# EAGLE design CoprocessorBoard3.0 (EAGLE 8.4.0)
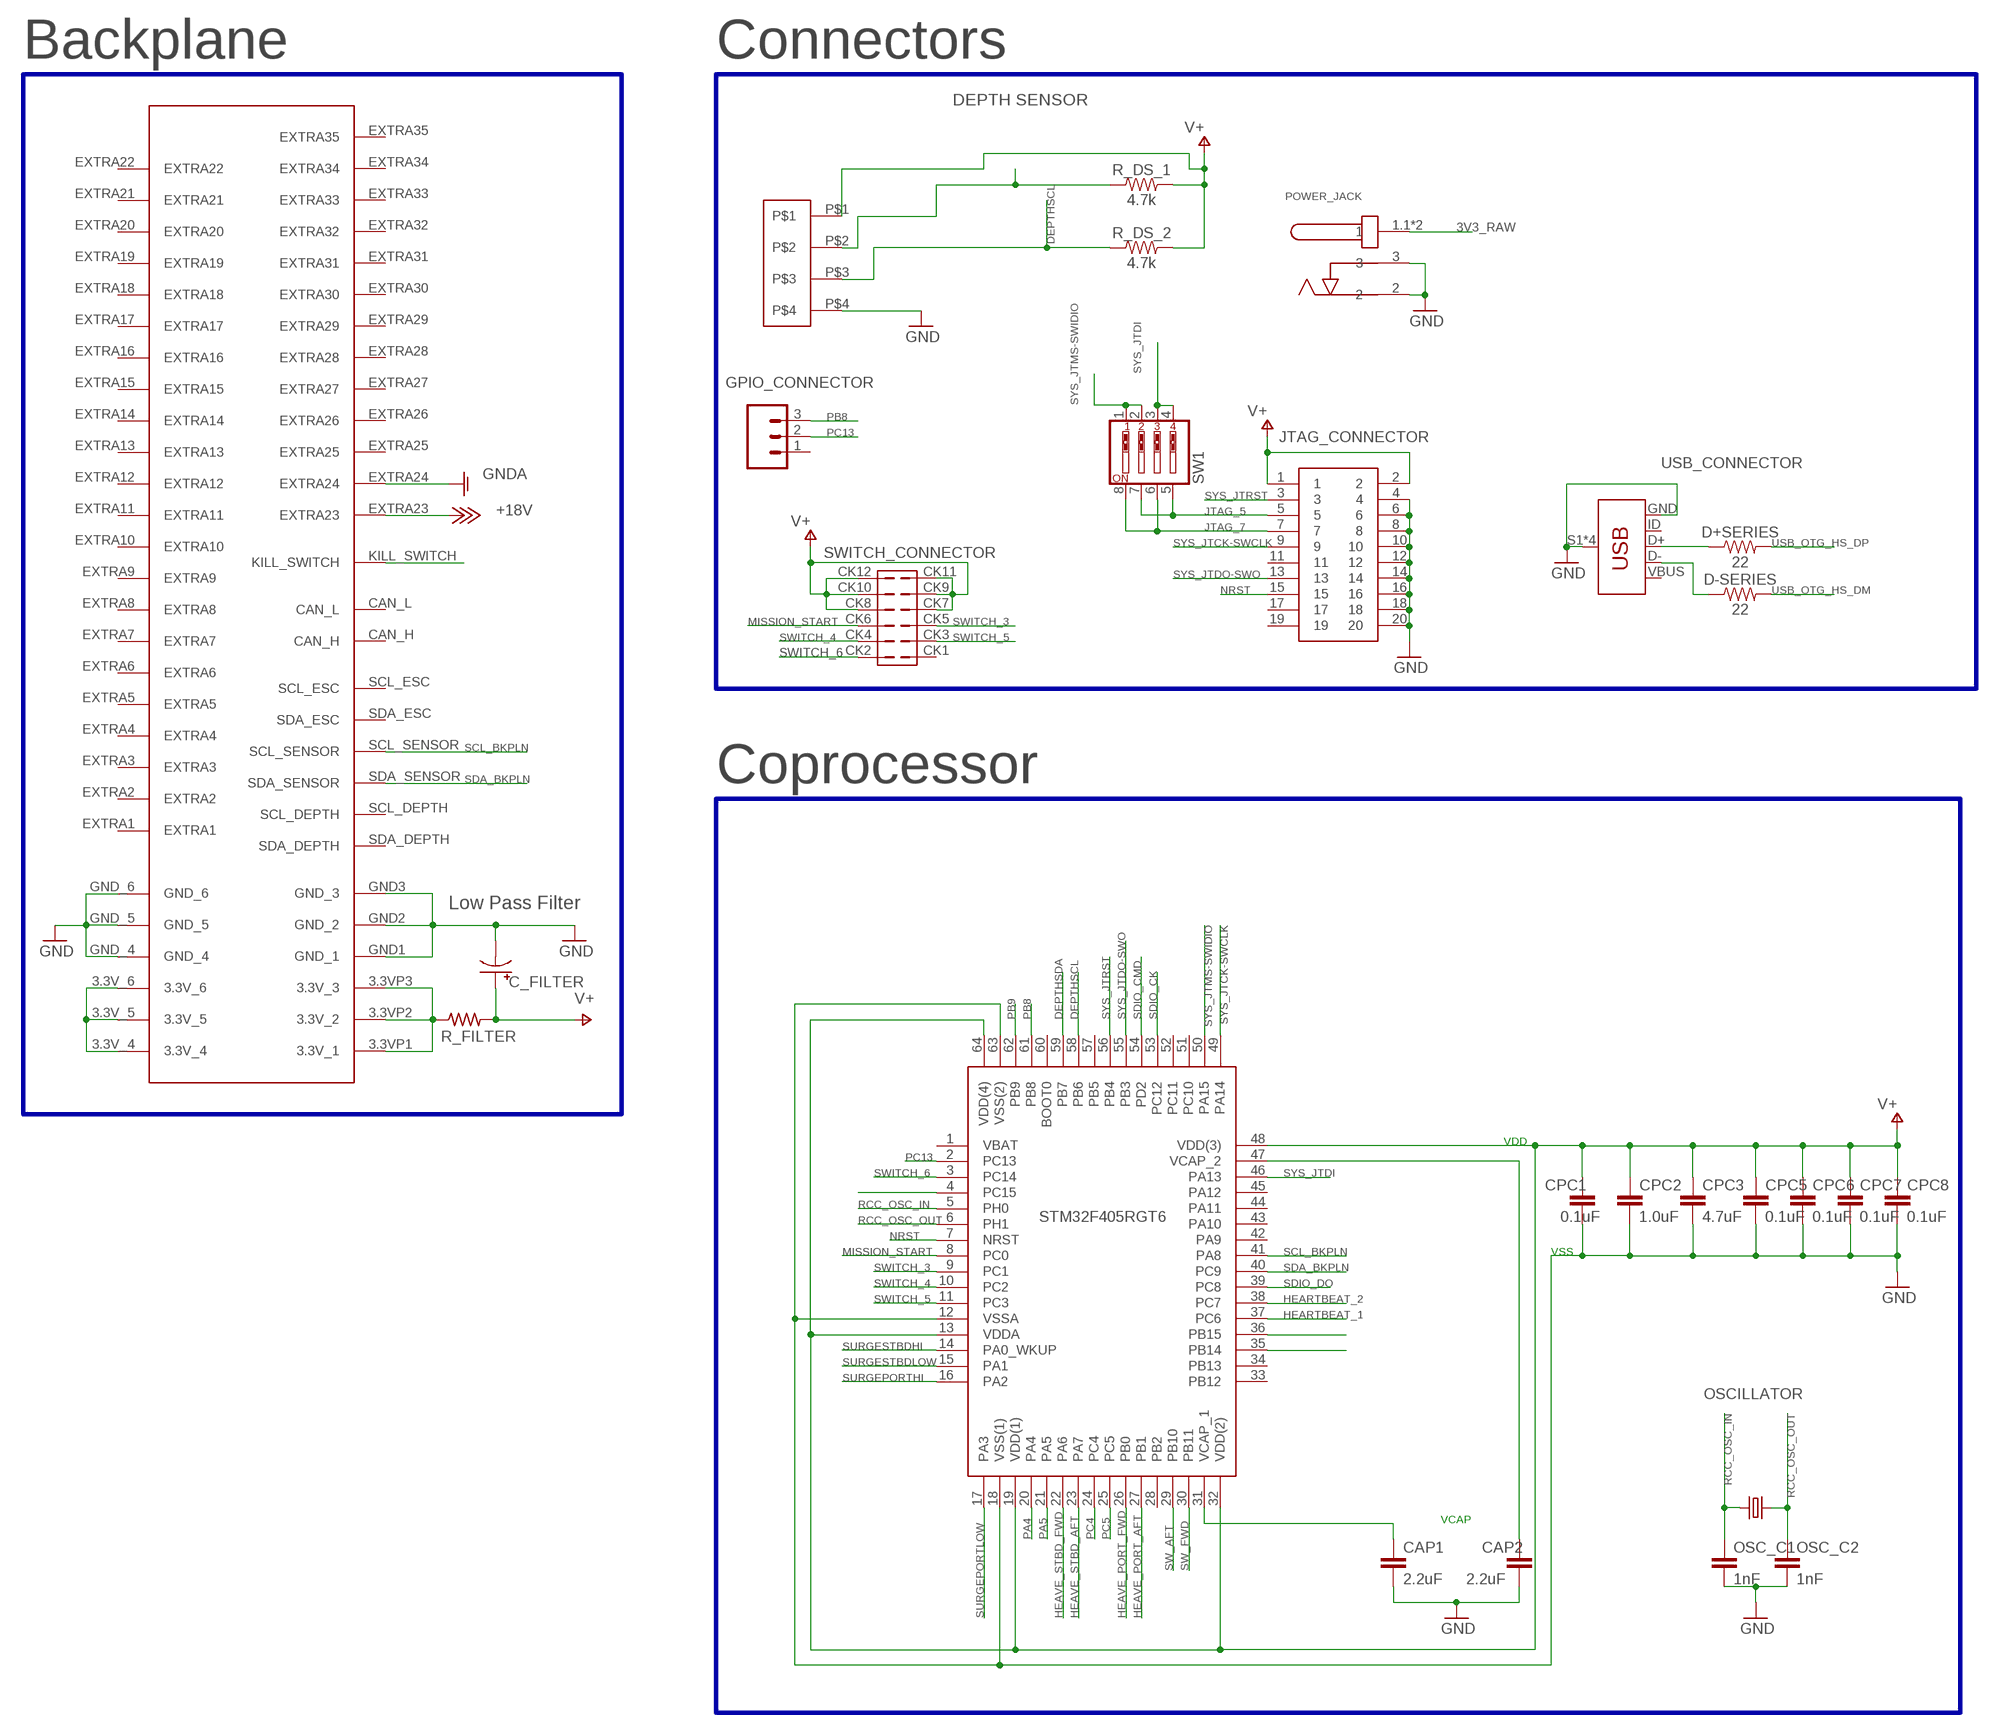
[diagram p0: schematic, sheet 1, part 1 of 2]
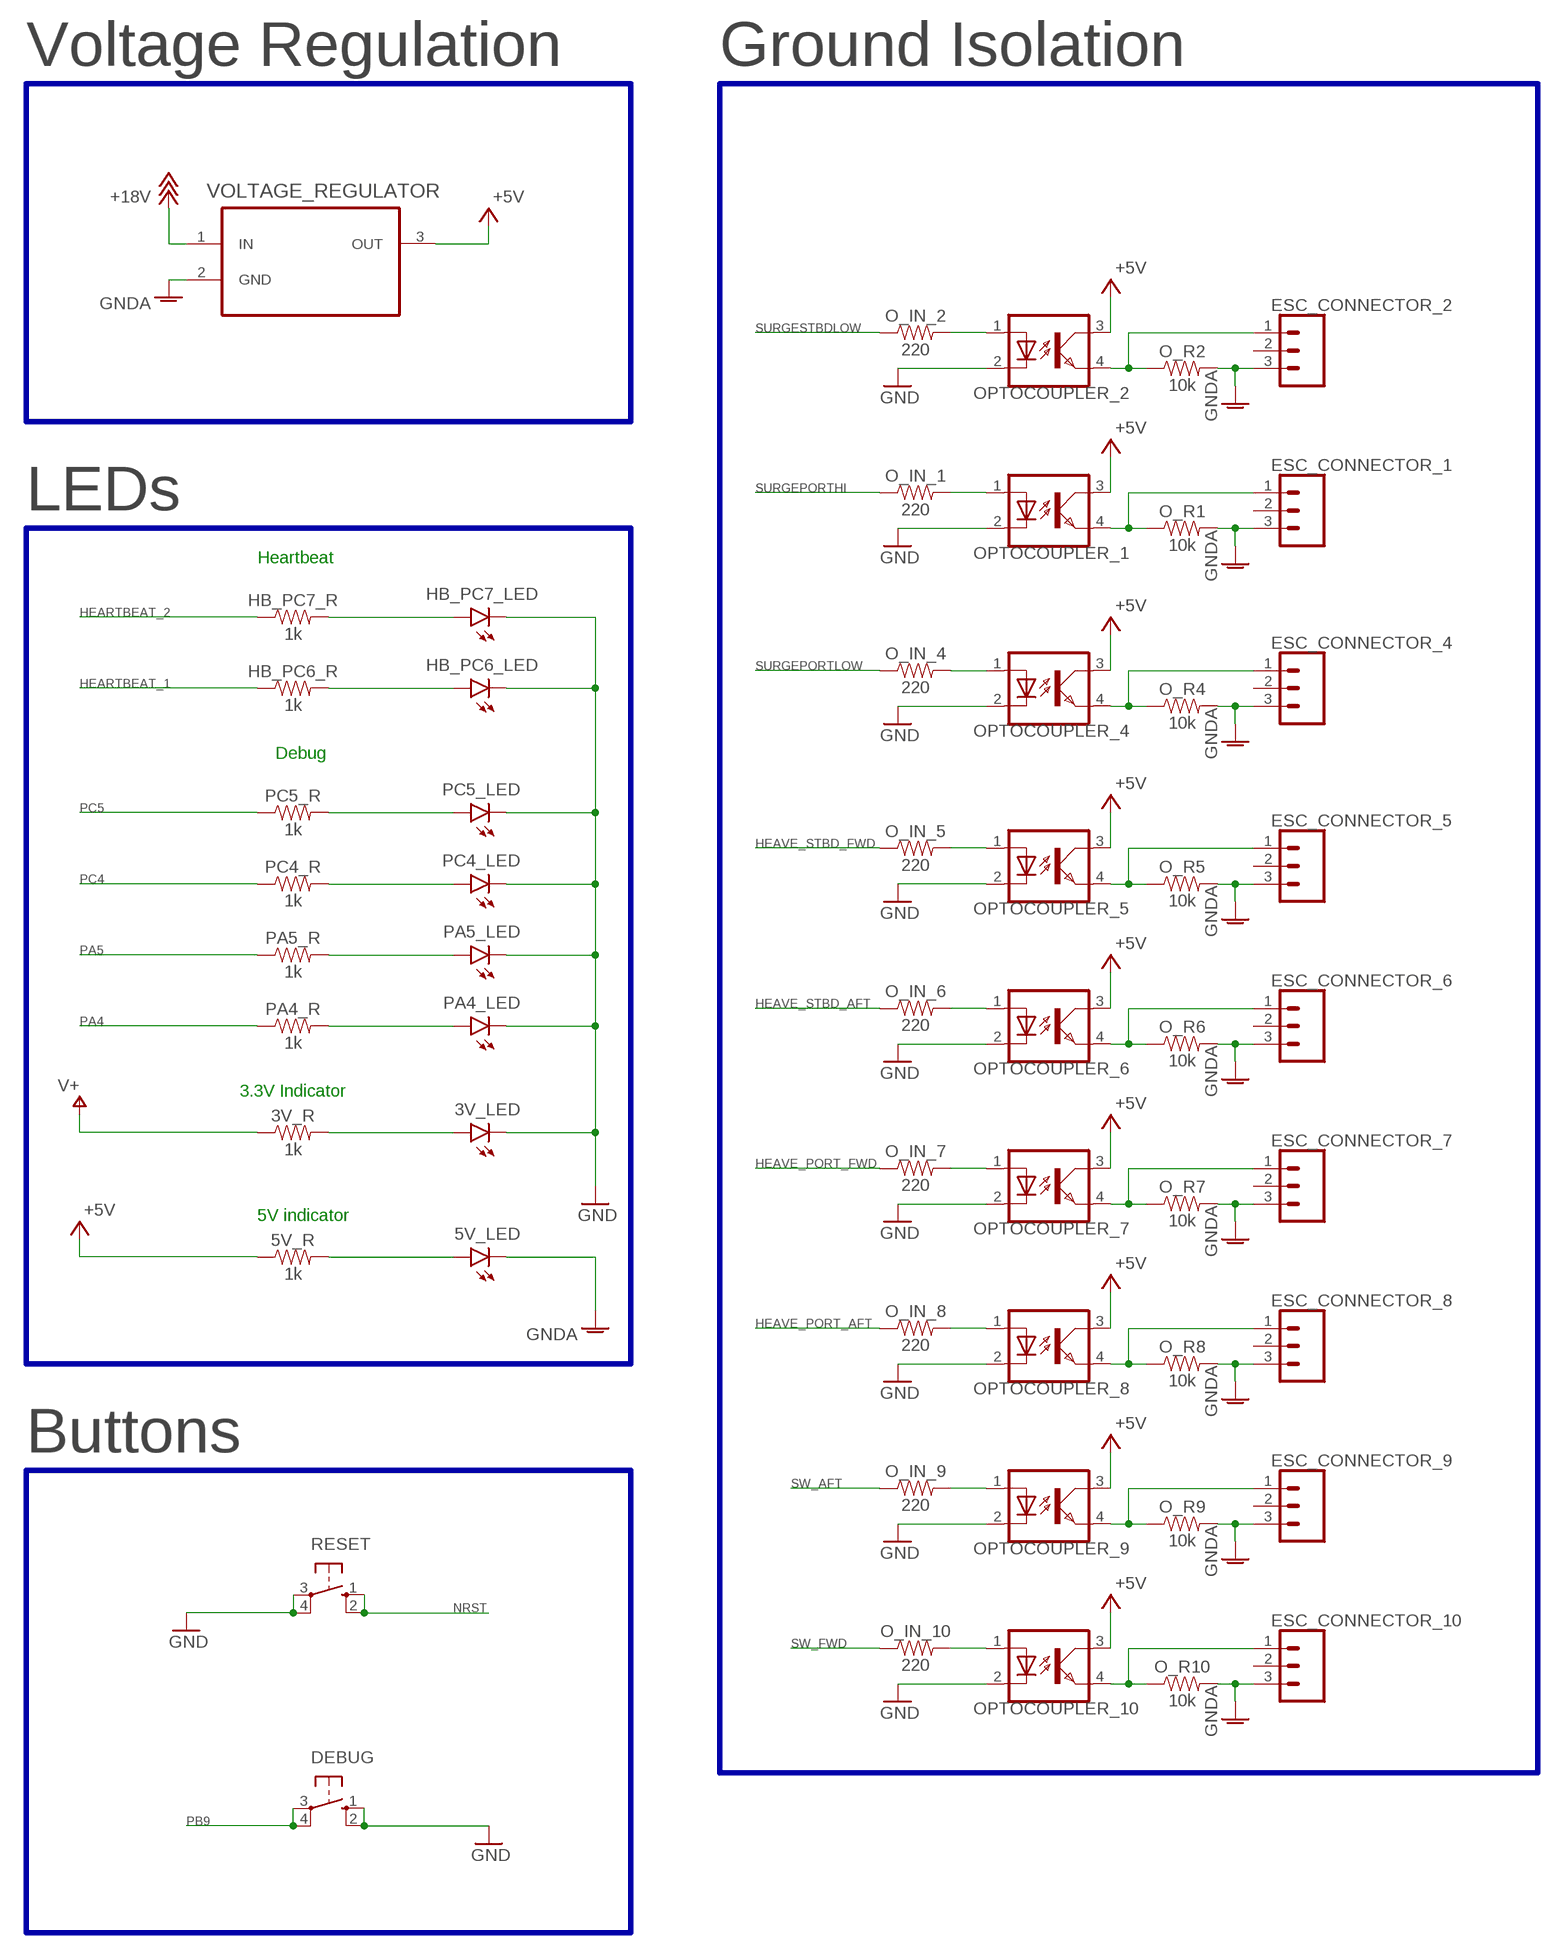
[diagram p1: schematic, sheet 1, part 2 of 2]

## Parts
3V_LED  WHITE  LED-WHITE0603  [LED-0603]
3V_R  1k  1KOHM-HORIZ-1/4W-1%  [AXIAL-0.3]
5V_LED  WHITE  LED-WHITE0603  [LED-0603]
5V_R  1k  1KOHM-HORIZ-1/4W-1%  [AXIAL-0.3]
C_FILTER  CPOL-USE2-5  [E2-5]
CAP1  2.2uF  2.2UF-0603-10V-20%  [0603]
CAP2  2.2uF  2.2UF-0603-10V-20%  [0603]
CPC1  0.1uF  1.0NF/1000PF-0603-50V-10%  [0603]
CPC2  1.0uF  1.0UF-0603-16V-10%  [0603]
CPC3  4.7uF  4.7UF0603  [0603]
CPC5  0.1uF  1.0NF/1000PF-0603-50V-10%  [0603]
CPC6  0.1uF  1.0NF/1000PF-0603-50V-10%  [0603]
CPC7  0.1uF  1.0NF/1000PF-0603-50V-10%  [0603]
CPC8  0.1uF  1.0NF/1000PF-0603-50V-10%  [0603]
D+SERIES  22  1KOHM-HORIZ-1/4W-1%  [AXIAL-0.3]
D-SERIES  22  1KOHM-HORIZ-1/4W-1%  [AXIAL-0.3]
DEBUG  10-XX  [B3F-10XX]
ESC_CONNECTOR_1  455-1750-1-ND  CONN_03  [1X03]
ESC_CONNECTOR_2  455-1750-1-ND  CONN_03  [1X03]
ESC_CONNECTOR_4  455-1750-1-ND  CONN_03  [1X03]
ESC_CONNECTOR_5  455-1750-1-ND  CONN_03  [1X03]
ESC_CONNECTOR_6  455-1750-1-ND  CONN_03  [1X03]
ESC_CONNECTOR_7  455-1750-1-ND  CONN_03  [1X03]
ESC_CONNECTOR_8  455-1750-1-ND  CONN_03  [1X03]
ESC_CONNECTOR_9  455-1750-1-ND  CONN_03  [1X03]
ESC_CONNECTOR_10  455-1750-1-ND  CONN_03  [1X03]
GPIO_CONNECTOR  455-1750-1-ND  CONN_03  [1X03]
HB_PC6_LED  WHITE  LED-WHITE0603  [LED-0603]
HB_PC6_R  1k  1KOHM-HORIZ-1/4W-1%  [AXIAL-0.3]
HB_PC7_LED  WHITE  LED-WHITE0603  [LED-0603]
HB_PC7_R  1k  1KOHM-HORIZ-1/4W-1%  [AXIAL-0.3]
IC1  STM32F405RGT6  [QFP50P1200X1200X160-64N]
JTAG_CONNECTOR  30320-6002HB  [SHDR20W81P254_2X10_3300X840X93]
O_IN_1  220  1KOHM-HORIZ-1/4W-1%  [AXIAL-0.3]
O_IN_2  220  1KOHM-HORIZ-1/4W-1%  [AXIAL-0.3]
O_IN_4  220  1KOHM-HORIZ-1/4W-1%  [AXIAL-0.3]
O_IN_5  220  1KOHM-HORIZ-1/4W-1%  [AXIAL-0.3]
O_IN_6  220  1KOHM-HORIZ-1/4W-1%  [AXIAL-0.3]
O_IN_7  220  1KOHM-HORIZ-1/4W-1%  [AXIAL-0.3]
O_IN_8  220  1KOHM-HORIZ-1/4W-1%  [AXIAL-0.3]
O_IN_9  220  1KOHM-HORIZ-1/4W-1%  [AXIAL-0.3]
O_IN_10  220  1KOHM-HORIZ-1/4W-1%  [AXIAL-0.3]
O_R1  10k  1KOHM-HORIZ-1/4W-1%  [AXIAL-0.3]
O_R2  10k  1KOHM-HORIZ-1/4W-1%  [AXIAL-0.3]
O_R4  10k  1KOHM-HORIZ-1/4W-1%  [AXIAL-0.3]
O_R5  10k  1KOHM-HORIZ-1/4W-1%  [AXIAL-0.3]
O_R6  10k  1KOHM-HORIZ-1/4W-1%  [AXIAL-0.3]
O_R7  10k  1KOHM-HORIZ-1/4W-1%  [AXIAL-0.3]
O_R8  10k  1KOHM-HORIZ-1/4W-1%  [AXIAL-0.3]
O_R9  10k  1KOHM-HORIZ-1/4W-1%  [AXIAL-0.3]
O_R10  10k  1KOHM-HORIZ-1/4W-1%  [AXIAL-0.3]
OPTOCOUPLER_1  SFH610  [DIL04]
OPTOCOUPLER_2  SFH610  [DIL04]
OPTOCOUPLER_4  SFH610  [DIL04]
OPTOCOUPLER_5  SFH610  [DIL04]
OPTOCOUPLER_6  SFH610  [DIL04]
OPTOCOUPLER_7  SFH610  [DIL04]
OPTOCOUPLER_8  SFH610  [DIL04]
OPTOCOUPLER_9  SFH610  [DIL04]
OPTOCOUPLER_10  SFH610  [DIL04]
OSC_C1  1nF  22PF-PTH-2.54MM-200V-5%  [CAP-PTH-2.54]
OSC_C2  1nF  22PF-PTH-2.54MM-200V-5%  [CAP-PTH-2.54]
OSCILLATOR  CRYSTALHC49S  [HC49/S]
PA4_LED  WHITE  LED-WHITE0603  [LED-0603]
PA4_R  1k  1KOHM-HORIZ-1/4W-1%  [AXIAL-0.3]
PA5_LED  WHITE  LED-WHITE0603  [LED-0603]
PA5_R  1k  1KOHM-HORIZ-1/4W-1%  [AXIAL-0.3]
PC4_LED  WHITE  LED-WHITE0603  [LED-0603]
PC4_R  1k  1KOHM-HORIZ-1/4W-1%  [AXIAL-0.3]
PC5_LED  WHITE  LED-WHITE0603  [LED-0603]
PC5_R  1k  1KOHM-HORIZ-1/4W-1%  [AXIAL-0.3]
POWER_JACK  PJ-002AH-SMT-TR  [CUI_PJ-002AH-SMT-TR]
R_DS_1  4.7k  1KOHM-HORIZ-1/4W-1%  [AXIAL-0.3]
R_DS_2  4.7k  1KOHM-HORIZ-1/4W-1%  [AXIAL-0.3]
R_FILTER  R-US_0204/7  [0204/7]
RESET  10-XX  [B3F-10XX]
SW1  SW_DIP-4  [EDG-04]
SWITCH_CONNECTOR  105314-2112  [105314-2112]
U$1  5530843  [5530843-6-BOARDFINGERS]
U$2  NANOFIT_4PIN_STR  [NANOFIT_4PIN_STR]
USB_CONNECTOR  USB_MINI-B_SMT  [USB-MINIB]
VOLTAGE_REGULATOR  L78M05CV  [TO254P450X1020X1935-3P]

## Nets
3V3: 3V_R.P$1 C_FILTER.+ CPC1.1 CPC2.1 CPC3.1 CPC5.1 CPC6.1 CPC7.1 CPC8.1 IC1.13(VDDA) IC1.19(VDD(1)) IC1.32(VDD(2)) IC1.48(VDD(3)) IC1.64(VDD(4)) JTAG_CONNECTOR.1 JTAG_CONNECTOR.2 R_DS_1.P$2 R_DS_2.P$2 R_FILTER.2 SWITCH_CONNECTOR.CK7 SWITCH_CONNECTOR.CK8 SWITCH_CONNECTOR.CK9 SWITCH_CONNECTOR.CK10 SWITCH_CONNECTOR.CK11 SWITCH_CONNECTOR.CK12 U$2.P$1 ; supply symbol labelled V+
3V3_RAW: POWER_JACK.1.1 POWER_JACK.1.2 R_FILTER.1 U$1.3.3V_4 U$1.3.3V_5 U$1.3.3V_6 U$1.3.3VP1(3.3V_1) U$1.3.3VP2(3.3V_2) U$1.3.3VP3(3.3V_3)
+5V: 5V_R.P$1 OPTOCOUPLER_1.3(COL) OPTOCOUPLER_2.3(COL) OPTOCOUPLER_4.3(COL) OPTOCOUPLER_5.3(COL) OPTOCOUPLER_6.3(COL) OPTOCOUPLER_7.3(COL) OPTOCOUPLER_8.3(COL) OPTOCOUPLER_9.3(COL) OPTOCOUPLER_10.3(COL) VOLTAGE_REGULATOR.3(OUT)
+18V: U$1.EXTRA23 VOLTAGE_REGULATOR.1(IN)
D+CON: D+SERIES.P$1 USB_CONNECTOR.D+
D-CON: D-SERIES.P$1 USB_CONNECTOR.D-
DEPTHSCL: IC1.58(PB6) R_DS_2.P$1 U$2.P$3
DEPTHSDA: IC1.59(PB7) R_DS_1.P$1 U$2.P$2
GND: 3V_LED.C C_FILTER.- CAP1.2 CAP2.2 CPC1.2 CPC2.2 CPC3.2 CPC5.2 CPC6.2 CPC7.2 CPC8.2 DEBUG.1(S) DEBUG.2(S1) HB_PC6_LED.C HB_PC7_LED.C IC1.12(VSSA) IC1.18(VSS(1)) IC1.63(VSS(2)) JTAG_CONNECTOR.4 JTAG_CONNECTOR.6 JTAG_CONNECTOR.8 JTAG_CONNECTOR.10 JTAG_CONNECTOR.12 JTAG_CONNECTOR.14 JTAG_CONNECTOR.16 JTAG_CONNECTOR.18 JTAG_CONNECTOR.20 OPTOCOUPLER_1.2(C) OPTOCOUPLER_2.2(C) OPTOCOUPLER_4.2(C) OPTOCOUPLER_5.2(C) OPTOCOUPLER_6.2(C) OPTOCOUPLER_7.2(C) OPTOCOUPLER_8.2(C) OPTOCOUPLER_9.2(C) OPTOCOUPLER_10.2(C) OSC_C1.2 OSC_C2.2 PA4_LED.C PA5_LED.C PC4_LED.C PC5_LED.C POWER_JACK.2 POWER_JACK.3 RESET.3(P) RESET.4(P1) U$1.GND1(GND_1) U$1.GND2(GND_2) U$1.GND3(GND_3) U$1.GND_4 U$1.GND_5 U$1.GND_6 U$2.P$4 USB_CONNECTOR.GND USB_CONNECTOR.S1(SHIELD) USB_CONNECTOR.S2(SHIELD) USB_CONNECTOR.S3(SHIELD) USB_CONNECTOR.S4(SHIELD)
GNDBAT: 5V_LED.C ESC_CONNECTOR_1.3 ESC_CONNECTOR_2.3 ESC_CONNECTOR_4.3 ESC_CONNECTOR_5.3 ESC_CONNECTOR_6.3 ESC_CONNECTOR_7.3 ESC_CONNECTOR_8.3 ESC_CONNECTOR_9.3 ESC_CONNECTOR_10.3 O_R1.P$2 O_R2.P$2 O_R4.P$2 O_R5.P$2 O_R6.P$2 O_R7.P$2 O_R8.P$2 O_R9.P$2 O_R10.P$2 U$1.EXTRA24 VOLTAGE_REGULATOR.2(GND) ; supply symbol labelled GNDA
HEARTBEAT_1: HB_PC6_R.P$1 IC1.37(PC6)
HEARTBEAT_2: HB_PC7_R.P$1 IC1.38(PC7)
HEAVE_PORT_AFT: IC1.27(PB1) O_IN_8.P$1
HEAVE_PORT_FWD: IC1.26(PB0) O_IN_7.P$1
HEAVE_STBD_AFT: IC1.23(PA7) O_IN_6.P$1
HEAVE_STBD_FWD: IC1.22(PA6) O_IN_5.P$1
JTAG_5: JTAG_CONNECTOR.5 SW1.5 SW1.7
JTAG_7: JTAG_CONNECTOR.7 SW1.6 SW1.8
KILL_SWITCH: IC1.4(PC15) U$1.KILL_SWITCH
MISSION_START: IC1.8(PC0) SWITCH_CONNECTOR.CK6
N$1: ESC_CONNECTOR_1.1 O_R1.P$1 OPTOCOUPLER_1.4(EMIT)
N$2: ESC_CONNECTOR_2.1 O_R2.P$1 OPTOCOUPLER_2.4(EMIT)
N$3: O_IN_1.P$2 OPTOCOUPLER_1.1(A)
N$6: ESC_CONNECTOR_4.1 O_R4.P$1 OPTOCOUPLER_4.4(EMIT)
N$7: ESC_CONNECTOR_5.1 O_R5.P$1 OPTOCOUPLER_5.4(EMIT)
N$8: ESC_CONNECTOR_6.1 O_R6.P$1 OPTOCOUPLER_6.4(EMIT)
N$9: ESC_CONNECTOR_7.1 O_R7.P$1 OPTOCOUPLER_7.4(EMIT)
N$10: ESC_CONNECTOR_8.1 O_R8.P$1 OPTOCOUPLER_8.4(EMIT)
N$11: ESC_CONNECTOR_9.1 O_R9.P$1 OPTOCOUPLER_9.4(EMIT)
N$12: ESC_CONNECTOR_10.1 O_R10.P$1 OPTOCOUPLER_10.4(EMIT)
N$13: O_IN_10.P$2 OPTOCOUPLER_10.1(A)
N$14: O_IN_9.P$2 OPTOCOUPLER_9.1(A)
N$15: O_IN_8.P$2 OPTOCOUPLER_8.1(A)
N$16: O_IN_7.P$2 OPTOCOUPLER_7.1(A)
N$17: O_IN_6.P$2 OPTOCOUPLER_6.1(A)
N$18: O_IN_5.P$2 OPTOCOUPLER_5.1(A)
N$19: O_IN_4.P$2 OPTOCOUPLER_4.1(A)
N$21: O_IN_2.P$2 OPTOCOUPLER_2.1(A)
N$36: HB_PC6_LED.A HB_PC6_R.P$2
N$37: HB_PC7_LED.A HB_PC7_R.P$2
N$38: PC5_LED.A PC5_R.P$2
N$39: PC4_LED.A PC4_R.P$2
N$40: PA5_LED.A PA5_R.P$2
N$41: PA4_LED.A PA4_R.P$2
N$42: 5V_LED.A 5V_R.P$2
N$43: 3V_LED.A 3V_R.P$2
NRST: IC1.7(NRST) JTAG_CONNECTOR.15 RESET.1(S) RESET.2(S1)
PA4: IC1.20(PA4) PA4_R.P$1
PA5: IC1.21(PA5) PA5_R.P$1
PB8: GPIO_CONNECTOR.3 IC1.61(PB8)
PB9: DEBUG.3(P) DEBUG.4(P1) IC1.62(PB9)
PC4: IC1.24(PC4) PC4_R.P$1
PC5: IC1.25(PC5) PC5_R.P$1
PC13: GPIO_CONNECTOR.2 IC1.2(PC13)
RCC_OSC_IN: IC1.5(PH0) OSC_C1.1 OSCILLATOR.1
RCC_OSC_OUT: IC1.6(PH1) OSC_C2.1 OSCILLATOR.2
SCL_BKPLN: IC1.41(PA8) U$1.SCL_SENSOR
SDA_BKPLN: IC1.40(PC9) U$1.SDA_SENSOR
SDIO_CK: IC1.53(PC12)
SDIO_CMD: IC1.54(PD2)
SDIO_DO: IC1.39(PC8)
SURGEPORTHI: IC1.16(PA2) O_IN_1.P$1
SURGEPORTLOW: IC1.17(PA3) O_IN_4.P$1
SURGESTBDHI: IC1.14(PA0_WKUP)
SURGESTBDLOW: IC1.15(PA1) O_IN_2.P$1
SW_AFT: IC1.29(PB10) O_IN_9.P$1
SW_FWD: IC1.30(PB11) O_IN_10.P$1
SWITCH_3: IC1.9(PC1) SWITCH_CONNECTOR.CK5
SWITCH_4: IC1.10(PC2) SWITCH_CONNECTOR.CK4
SWITCH_5: IC1.11(PC3) SWITCH_CONNECTOR.CK3
SWITCH_6: IC1.3(PC14) SWITCH_CONNECTOR.CK2
SYS_JTCK-SWCLK: IC1.49(PA14) JTAG_CONNECTOR.9
SYS_JTDI: IC1.46(PA13) SW1.3 SW1.4
SYS_JTDO-SWO: IC1.55(PB3) JTAG_CONNECTOR.13
SYS_JTMS-SWIDIO: IC1.50(PA15) SW1.1 SW1.2
SYS_JTRST: IC1.56(PB4) JTAG_CONNECTOR.3
USB_OTG_HS_DM: D-SERIES.P$2 IC1.35(PB14)
USB_OTG_HS_DP: D+SERIES.P$2 IC1.36(PB15)
VCAP1: CAP1.1 IC1.31(VCAP_1)
VCAP2: CAP2.1 IC1.47(VCAP_2)
Unconnected: ESC_CONNECTOR_1.2 ESC_CONNECTOR_2.2 ESC_CONNECTOR_4.2 ESC_CONNECTOR_5.2 ESC_CONNECTOR_6.2 ESC_CONNECTOR_7.2 ESC_CONNECTOR_8.2 ESC_CONNECTOR_9.2 ESC_CONNECTOR_10.2 GPIO_CONNECTOR.1 IC1.1(VBAT) IC1.28(PB2) IC1.33(PB12) IC1.34(PB13) IC1.42(PA9) IC1.43(PA10) IC1.44(PA11) IC1.45(PA12) IC1.51(PC10) IC1.52(PC11) IC1.57(PB5) IC1.60(BOOT0) JTAG_CONNECTOR.11 JTAG_CONNECTOR.17 JTAG_CONNECTOR.19 SWITCH_CONNECTOR.CK1 U$1.CAN_H U$1.CAN_L U$1.EXTRA1 U$1.EXTRA2 U$1.EXTRA3 U$1.EXTRA4 U$1.EXTRA5 U$1.EXTRA6 U$1.EXTRA7 U$1.EXTRA8 U$1.EXTRA9 U$1.EXTRA10 U$1.EXTRA11 U$1.EXTRA12 U$1.EXTRA13 U$1.EXTRA14 U$1.EXTRA15 U$1.EXTRA16 U$1.EXTRA17 U$1.EXTRA18 U$1.EXTRA19 U$1.EXTRA20 U$1.EXTRA21 U$1.EXTRA22 U$1.EXTRA25 U$1.EXTRA26 U$1.EXTRA27 U$1.EXTRA28 U$1.EXTRA29 U$1.EXTRA30 U$1.EXTRA31 U$1.EXTRA32 U$1.EXTRA33 U$1.EXTRA34 U$1.EXTRA35 U$1.SCL_DEPTH U$1.SCL_ESC U$1.SDA_DEPTH U$1.SDA_ESC USB_CONNECTOR.ID

## Buses
B$1
B$2
B$3
B$4
B$5
B$6
B$7

## Notes on the sheet
- Backplane | Connectors | Voltage Regulation | Ground Isolation
- DEPTH SENSOR
- LEDs
- Heartbeat
- Debug
- Coprocessor
- Low Pass Filter
- 3.3V Indicator
- 5V indicator
- VDD
- VSS
- Buttons
- VCAP

## Power pins joined to a net without a drawn wire
VBUS: USB_CONNECTOR.VBUS

## Library data of the parts
3V_LED 5V_LED = SparkFun-LED:LED-WHITE: White SMD LED Used in manufacturing several products at SparkFun. Packages: 0603 - Bright White SMD 0603 package[Product Link] <http://www.kingbrightusa.com/product.asp?catalog_name=LED&product_id=APT1608QWF/D> 1206 - Bright White SMD1206 package [Product Link] <http://www.kingbrightusa.com/product.asp?catalog_name=LED&product_id=APT3216QWF/D> 3014 - Super Bright SMD 3014 package [Datasheet] <http://www.lumileds.com/uploads/459/DS208-pdf> SparkFun Products: Blackberry Trackballer Breakout <https://www.sparkfun.com/products/13169> Digital SandBox <https://www.sparkfun.com/products/12651>; PROD_ID: DIO-09004; SPICEPREFIX: B
3V_R 5V_R HB_PC6_R HB_PC7_R PA4_R PA5_R PC4_R PC5_R = SparkFun-Resistors:1KOHM: 1kΩ resistor A resistor is a passive two-terminal electrical component that implements electrical resistance as a circuit element. Resistors act to reduce current flow, and, at the same time, act to lower voltage levels within circuits. - Wikipedia; PROD_ID: RES-12182; SPICEPREFIX: R
C_FILTER = rcl:CPOL-US: POLARIZED CAPACITOR, American symbol
CAP1 CAP2 = SparkFun-Capacitors:2.2UF: 2.2µF ceramic capacitors A capacitor is a passive two-terminal electrical component used to store electrical energy temporarily in an electric field.; PROD_ID: CAP-07888
CPC1 CPC5-CPC8 = SparkFun-Capacitors:1.0NF/1000PF: 1nF/1,000pF ceramic capacitors A capacitor is a passive two-terminal electrical component used to store electrical energy temporarily in an electric field.; PROD_ID: CAP-07886; VALUE: 1nF
CPC2 = SparkFun-Capacitors:1.0UF: 1µF ceramic capacitors A capacitor is a passive two-terminal electrical component used to store electrical energy temporarily in an electric field.; PROD_ID: CAP-00868
CPC3 = SparkFun-Capacitors:4.7UF: 4.7µF ceramic capacitors A capacitor is a passive two-terminal electrical component used to store electrical energy temporarily in an electric field.; PROD_ID: CAP-08280
D+SERIES D-SERIES O_R1 O_R2 O_R4-O_R10 R_DS_1 R_DS_2 = SparkFun-Resistors:1KOHM: 1kΩ resistor A resistor is a passive two-terminal electrical component that implements electrical resistance as a circuit element. Resistors act to reduce current flow, and, at the same time, act to lower voltage levels within circuits. - Wikipedia; PROD_ID: RES-12182; VALUE: 1k
DEBUG RESET = switch-omron:10-XX: OMRON SWITCH; MPN: B3F-1000; OC_FARNELL: 176432; OC_NEWARK: 36M3542
ESC_CONNECTOR_1 ESC_CONNECTOR_2 ESC_CONNECTOR_4-ESC_CONNECTOR_10 GPIO_CONNECTOR = SparkFun-Connectors:CONN_03: Multi connection point. Often used as Generic Header-pin footprint for 0.1 inch spaced/style header connections On any of the 0.1 inch spaced packages, you can populate with these: Break Away Headers - Straight <https://www.sparkfun.com/products/116> (PRT-00116) Break Away Male Headers - Right Angle <https://www.sparkfun.com/products/553> (PRT-00553) Female Headers <https://www.sparkfun.com/products/115> (PRT-00115) Break Away Headers - Machine Pin <https://www.sparkfun.com/products/117> (PRT-00117) Break Away Female Headers - Swiss Machine Pin <https://www.sparkfun.com/products/743> (PRT-00743) Stackable Header - 3 Pin (Female, 0.1") <https://www.sparkfun.com/products/13875> (PRT-13875) For SCREWTERMINALS and SPRING TERMINALS visit here: Screw Terimnals on SparkFun.com <https://www.sparkfun.com/search/results?term=Screw+Terminals> (5mm/3.5mm/2.54mm spacing) This device is also useful as a general connection point to wire up your design to another part of your project. Our various solder wires solder well into these plated through hole pads. Hook-Up Wire - Assortment (Stranded, 22 AWG) <https://www.sparkfun.com/products/11375> (PRT-11375) Hook-Up Wire - Assortment (Solid Core, 22 AWG) <https://www.sparkfun.com/products/11367> (PRT-11367) View the entire wire category on our website here <https://www.sparkfun.com/categories/141> Special notes: Molex polarized connector foot print use with SKU : PRT-08232 with associated crimp pins and housings.; PROD_ID: XXX-00000
HB_PC6_LED HB_PC7_LED PA4_LED PA5_LED PC4_LED PC5_LED = SparkFun-LED:LED-WHITE: White SMD LED Used in manufacturing several products at SparkFun. Packages: 0603 - Bright White SMD 0603 package[Product Link] <http://www.kingbrightusa.com/product.asp?catalog_name=LED&product_id=APT1608QWF/D> 1206 - Bright White SMD1206 package [Product Link] <http://www.kingbrightusa.com/product.asp?catalog_name=LED&product_id=APT3216QWF/D> 3014 - Super Bright SMD 3014 package [Datasheet] <http://www.lumileds.com/uploads/459/DS208-pdf> SparkFun Products: Blackberry Trackballer Breakout <https://www.sparkfun.com/products/13169> Digital SandBox <https://www.sparkfun.com/products/12651>; PROD_ID: DIO-09004
IC1 = STM32F405RGT6:STM32F405RGT6: MCU 32-Bit, ARM Cortex M4, 1MB Flash STMicroelectronics STM32F405RGT6, 32bit ARM Cortex M4F Microcontroller, 168MHz, 1024 kB Flash, 64-Pin LQFP <https://componentsearchengine.com/Images/3/STM32F405RGT6.jpg> Source: Datasheet <http://www.st.com/web/en/resource/technical/document/datasheet/DM00037051.pdf>; ALLIED_NUMBER: 70391099; DESCRIPTION: MCU 32-Bit, ARM Cortex M4, 1MB Flash STMicroelectronics STM32F405RGT6, 32bit ARM Cortex M4F Microcontroller, 168MHz, 1024 kB Flash, 64-Pin LQFP; HEIGHT: 1.6mm; MANUFACTURER_NAME: STMicroelectronics; MANUFACTURER_PART_NUMBER: STM32F405RGT6; RS_PART_NUMBER: 7468217; SUPPLIER_NAME: RS
JTAG_CONNECTOR = 30320-6002HB:30320-6002HB: Header 20 position 3M 303 Series, 2.54mm Pitch 20 Way 2 Row Shrouded Straight PCB Header, Through Hole, Solder Termination <https://componentsearchengine.com/Images/3/30320-6002HB.jpg> Source: Datasheet <http://multimedia.3m.com/mws/media/22504O/3mtm-100-in-loprof-hdr-100x-100strt-ra-4-wall-ts0818.pdf>; DESCRIPTION: Header 20 position 3M 303 Series, 2.54mm Pitch 20 Way 2 Row Shrouded Straight PCB Header, Through Hole, Solder Termination; HEIGHT: 9.3mm; MANUFACTURER_NAME: 3M; MANUFACTURER_PART_NUMBER: 30320-6002HB; RS_PART_NUMBER: 8273587; SUPPLIER_NAME: RS
O_IN_1 O_IN_2 O_IN_4-O_IN_10 = SparkFun-Resistors:1KOHM: 1kΩ resistor A resistor is a passive two-terminal electrical component that implements electrical resistance as a circuit element. Resistors act to reduce current flow, and, at the same time, act to lower voltage levels within circuits. - Wikipedia; PROD_ID: RES-12182; SPICEPREFIX: R; VALUE: 1k
OPTOCOUPLER_1 OPTOCOUPLER_2 OPTOCOUPLER_4-OPTOCOUPLER_10 = optocoupler:SFH610: SIEMENS OPTO COUPLER; MF: VISHAY/TELEFUNKEN; MPN: SFH6106-4; OC_FARNELL: 1469568; OC_NEWARK: 58K2193
OSC_C1 OSC_C2 = SparkFun-Capacitors:22PF: 22pF ceramic capacitors A capacitor is a passive two-terminal electrical component used to store electrical energy temporarily in an electric field.; PROD_ID: CAP-09128; VALUE: 22pF
OSCILLATOR = crystal:CRYSTAL: CRYSTAL; OC_FARNELL: 1667008; OC_NEWARK: unknown
POWER_JACK = PJ-002AH-SMT-TR:PJ-002AH-SMT-TR: PJ-002 Series 2 x 6.5 mm 24 V Right Angle SMT Power Jack; AVAILABILITY: Good; DESCRIPTION: 24 VDC 5 A Surface Mount Unshielded 2 Conductors 3 Contacts Male Power Jack; MF: CUI; MP: PJ-002AH-SMT-TR; PACKAGE: None; PRICE: 0.98 USD
R_FILTER = rcl:R-US_: RESISTOR, American symbol
SW1 = special:SW_DIP-4: DIP SWITCH
SWITCH_CONNECTOR = 105314-2112 nanofit hdr:105314-2112
U$1 = 5530843-6:5530843; SPICEPREFIX: X
U$2 = nanofit_4pin_str:NANOFIT_4PIN_STR
USB_CONNECTOR = SparkFun-Connectors:USB_MINI-B: USB type Mini-B Connector Breaks out 5th pin, and includes shield pins if needed. SparkFun Products: SparkFun FTDI Basic Breakout <https://www.sparkfun.com/products/9716> SparkFun XBee Explorer USB <https://www.sparkfun.com/products/11812> SparkFun Redboard <https://www.sparkfun.com/products/12757>; PROD_ID: CONN-08193; SF_ID: PRT-00587
VOLTAGE_REGULATOR = L78M05CV:L78M05CV: Precision 500 mA regulators; AVAILABILITY: Good; DESCRIPTION: L78M05 Series 5 V 500 mA Three Terminal Positive Voltage Regulator - TO-220; MF: STMicroelectronics; MP: L78M05CV; PACKAGE: TO-220 STMicroelectronics; PRICE: 0.29 USD

## Module CHIP
Ports: 

### Library data of the parts

## Board
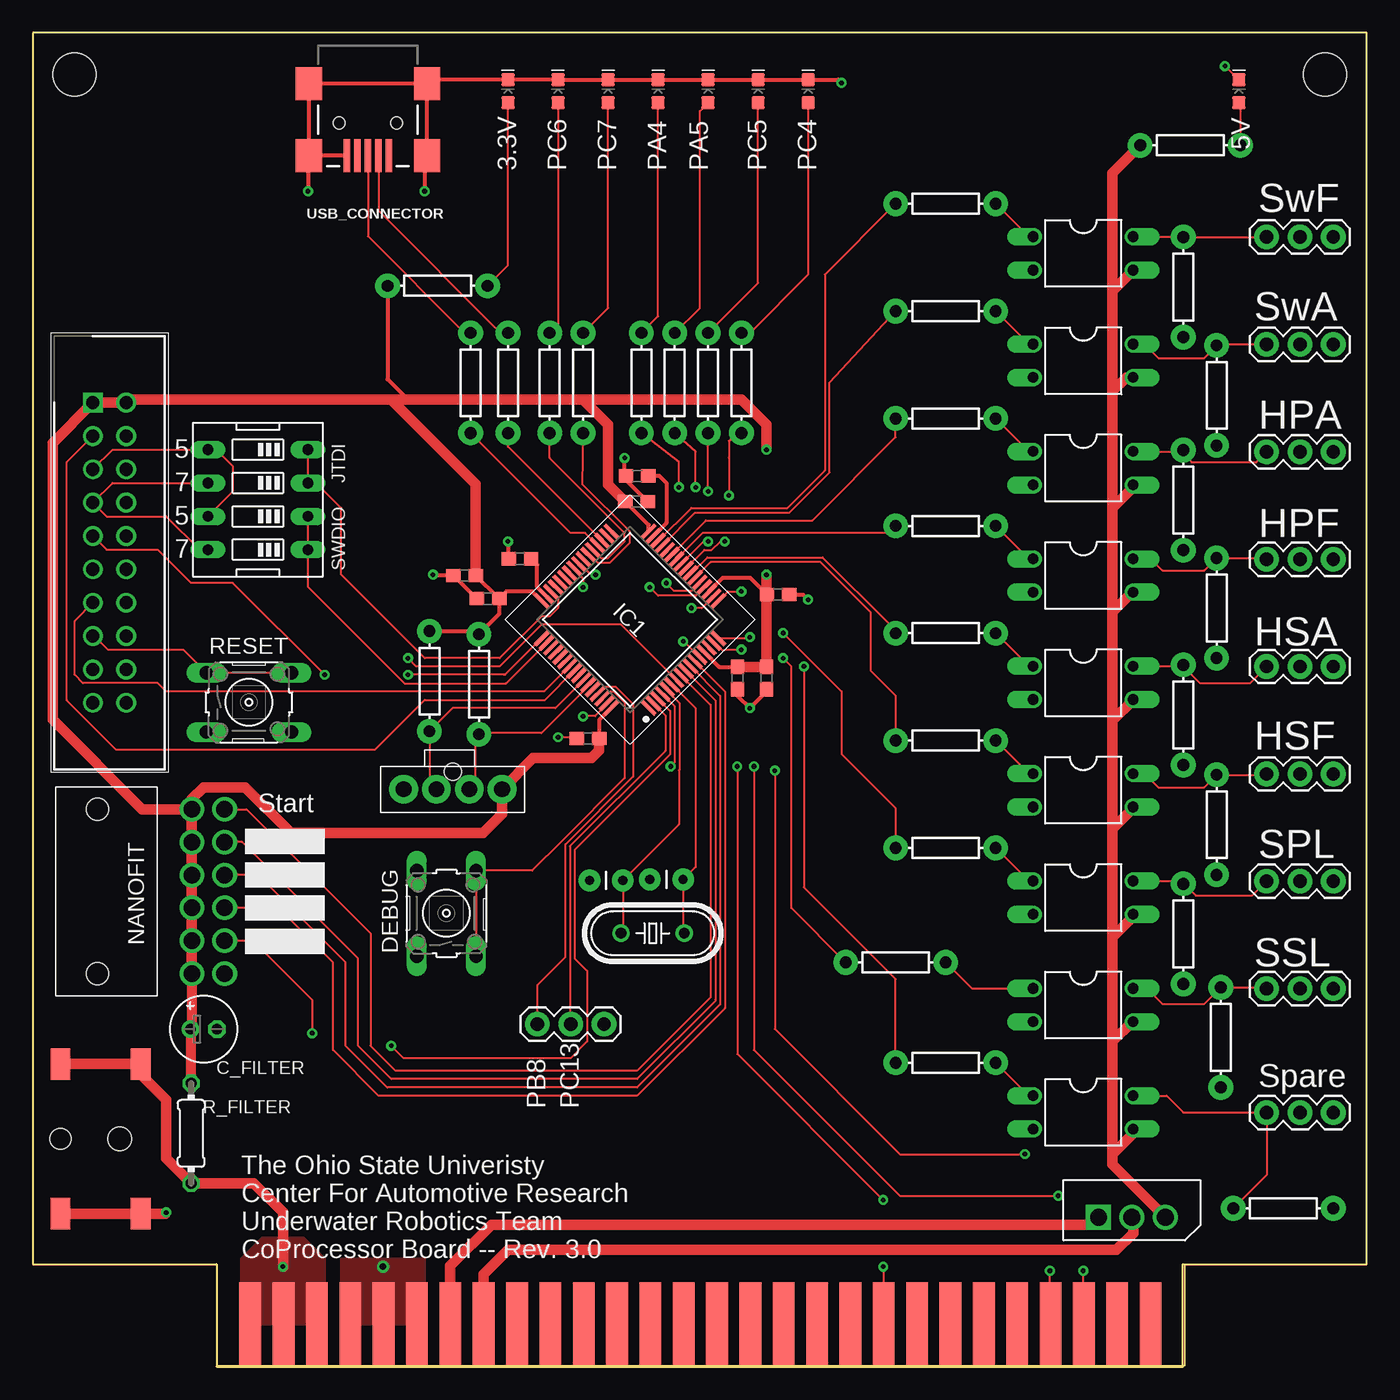
[diagram p2: board, top side]
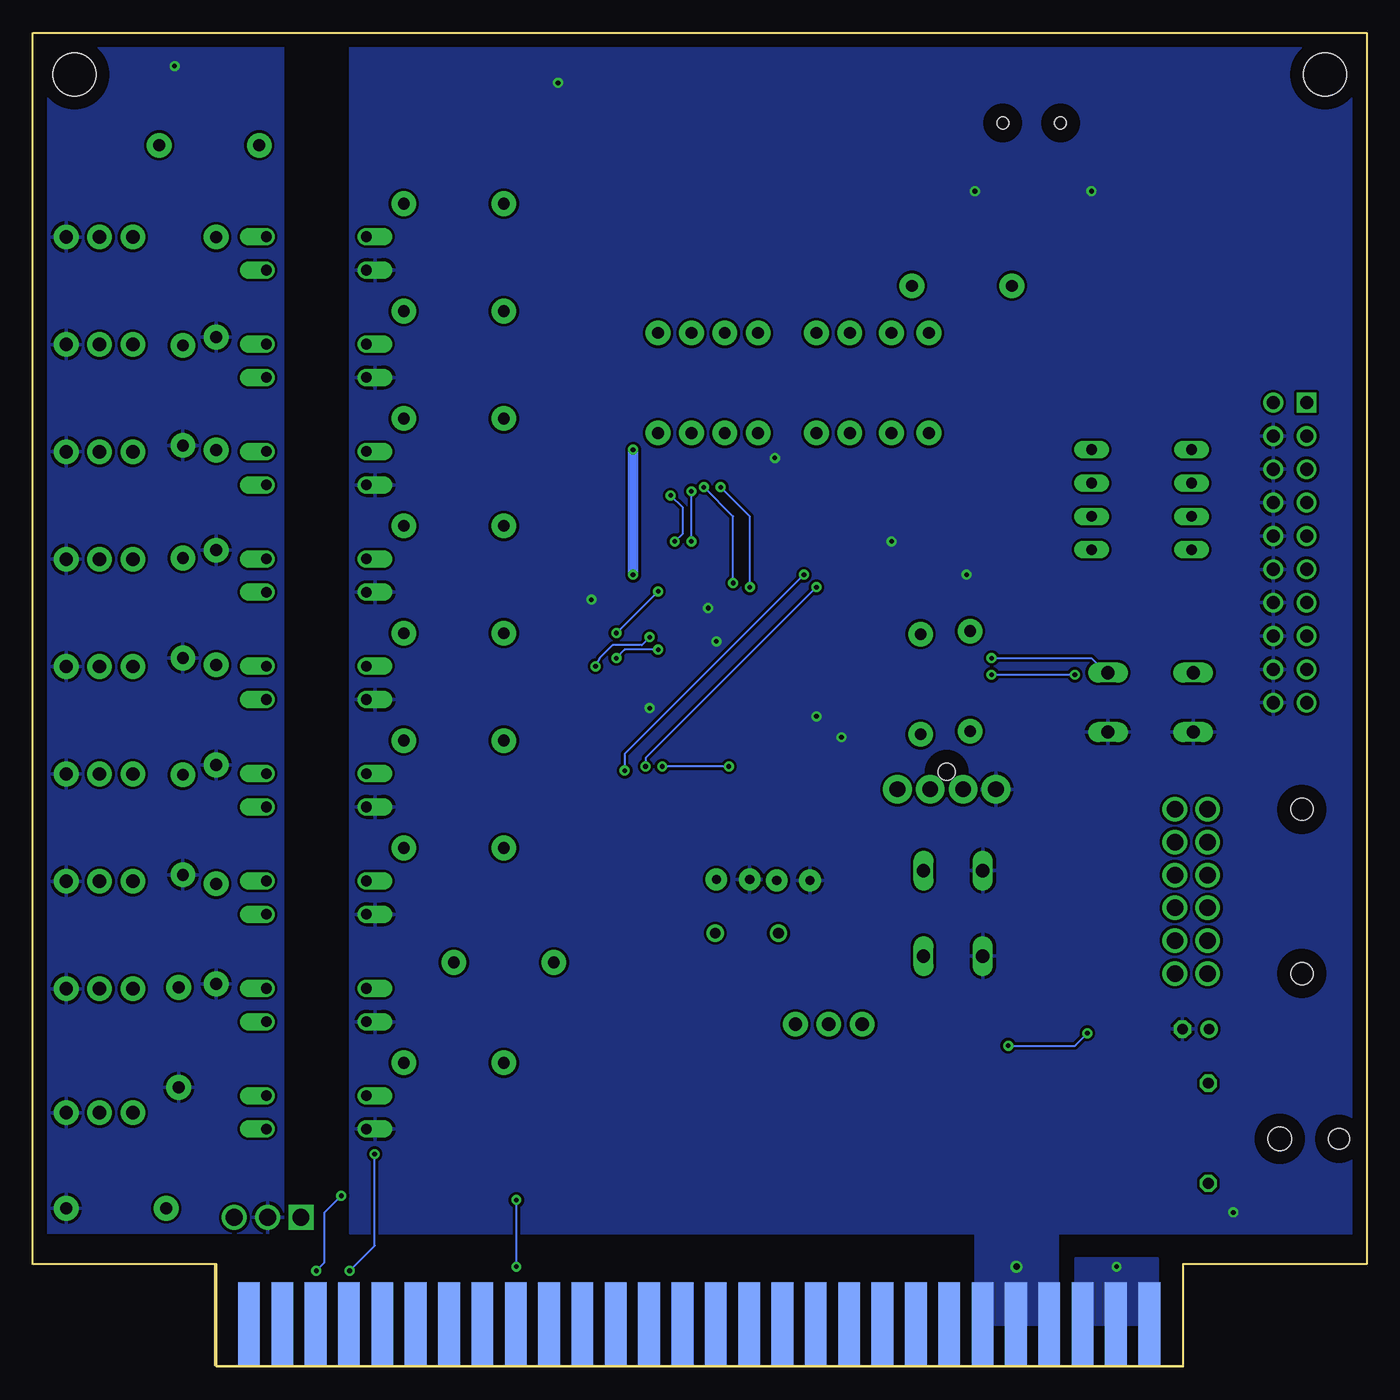
[diagram p3: board, bottom side, seen from below]

Size 101.6 x 101.6 mm. Coordinates in mm from the lower left corner, seen from the top.
Outline: 14,0 87.6,0 87.6,7.8 101.6,7.8 101.6,101.6 0,101.6 0,7.8 14,7.8 14,0
Copper layers (1*16): Top 0.035mm / dielectric 1.5mm / Bottom 0.035mm
Design rules "battery_balancer": minimum track width 6mil, minimum drill 0.35mm, track to track 0.205mm, track to pad 0.205mm, pad to pad 0.205mm, via to via 0.205mm, smd to smd 6mil, copper to edge 40mil, drill to drill 6mil, minimum pad ring 10mil, minimum via ring 8mil, stop-mask expansion 4mil, vias tented up to drill 0mil, thermal gap 10mil
Holes 3.26 mm at 3.17,98.42 98.42,98.42

### Footprints (pad centres in the part's own frame; a part is rotated, then mirrored left to right if it is on the bottom)
LED-0603 = smd 1 x 1: A -0.877,0; C 0.877,0
AXIAL-0.3 = drill 0.9 pad 1.88: P$1 -3.81,0; P$2 3.81,0
E2-5 = drill 0.813 pad 1.27: + -1.016,0 | drill 0.813 pad 1.27 octagon: - 1.016,0
0603 = smd 1.1 x 1: 1 -0.85,0; 2 0.85,0
B3F-10XX = drill 1.016 long: 1 -3.251,2.261; 2 3.251,2.261; 3 -3.251,-2.261; 4 3.251,-2.261
1X03 = drill 1.016 pad 1.88: 1 0,0; 2 2.54,0; 3 5.08,0
QFP50P1200X1200X160-64N = smd 1.45 x 0.3: 1 -5.75,3.75; 2 -5.75,3.25; 3 -5.75,2.75; 4 -5.75,2.25; 5 -5.75,1.75; 6 -5.75,1.25; 7 -5.75,0.75; 8 -5.75,0.25; 9 -5.75,-0.25; 10 -5.75,-0.75; 11 -5.75,-1.25; 12 -5.75,-1.75; 13 -5.75,-2.25; 14 -5.75,-2.75; 15 -5.75,-3.25; 16 -5.75,-3.75; 33 5.75,-3.75; 34 5.75,-3.25; 35 5.75,-2.75; 36 5.75,-2.25; 37 5.75,-1.75; 38 5.75,-1.25; 39 5.75,-0.75; 40 5.75,-0.25; 41 5.75,0.25; 42 5.75,0.75; 43 5.75,1.25; 44 5.75,1.75; 45 5.75,2.25; 46 5.75,2.75; 47 5.75,3.25; 48 5.75,3.75 | smd 0.3 x 1.45: 17 -3.75,-5.75; 18 -3.25,-5.75; 19 -2.75,-5.75; 20 -2.25,-5.75; 21 -1.75,-5.75; 22 -1.25,-5.75; 23 -0.75,-5.75; 24 -0.25,-5.75; 25 0.25,-5.75; 26 0.75,-5.75; 27 1.25,-5.75; 28 1.75,-5.75; 29 2.25,-5.75; 30 2.75,-5.75; 31 3.25,-5.75; 32 3.75,-5.75; 49 3.75,5.75; 50 3.25,5.75; 51 2.75,5.75; 52 2.25,5.75; 53 1.75,5.75; 54 1.25,5.75; 55 0.75,5.75; 56 0.25,5.75; 57 -0.25,5.75; 58 -0.75,5.75; 59 -1.25,5.75; 60 -1.75,5.75; 61 -2.25,5.75; 62 -2.75,5.75; 63 -3.25,5.75; 64 -3.75,5.75
SHDR20W81P254_2X10_3300X840X93 = drill 1 pad 1.5 square: 1 0,0 | drill 1 pad 1.5: 2 0,2.54; 3 2.54,0; 4 2.54,2.54; 5 5.08,0; 6 5.08,2.54; 7 7.62,0; 8 7.62,2.54; 9 10.16,0; 10 10.16,2.54; 11 12.7,0; 12 12.7,2.54; 13 15.24,0; 14 15.24,2.54; 15 17.78,0; 16 17.78,2.54; 17 20.32,0; 18 20.32,2.54; 19 22.86,0; 20 22.86,2.54
DIL04 = drill 0.813 offset: 1 -1.27,-3.81; 2 1.27,-3.81; 3 1.27,3.81; 4 -1.27,3.81
CAP-PTH-2.54 = drill 0.7 pad 1.651: 1 -1.27,0; 2 1.27,0
HC49/S = drill 0.813: 1 -2.413,0; 2 2.413,0
CUI_PJ-002AH-SMT-TR = smd 1.5 x 2.4: 1.1 -3.05,5.7; 1.2 3.05,5.7; 2 -3.05,-5.7; 3 3.05,-5.7 | hole 1.6: -3.05,0 | hole 1.8: 1.45,0
0204/7 = drill 0.813 octagon: 1 -3.81,0; 2 3.81,0
EDG-04 = drill 0.813 long: 1 -3.81,-3.81; 2 -1.27,-3.81; 3 1.27,-3.81; 4 3.81,-3.81; 5 3.81,3.81; 6 1.27,3.81; 7 -1.27,3.81; 8 -3.81,3.81
105314-2112 = drill 1.25: CK1 12.5,2.5; CK2 10,2.5; CK3 7.5,2.5; CK4 5,2.5; CK5 2.5,2.5; CK6 0,2.5; CK7 12.5,0; CK8 10,0; CK9 7.5,0; CK10 5,0; CK11 2.5,0; CK12 0,0 | hole 1.7: 0,-7.18; 12.5,-7.18
5530843-6-BOARDFINGERS = smd 1.651 x 6.35 bottom: 3.3V_4 0.826,3.175; 3.3V_5 3.365,3.175; 3.3V_6 5.905,3.175; EXTRA1 16.066,3.175; EXTRA2 18.605,3.175; EXTRA3 21.145,3.175; EXTRA4 23.686,3.175; EXTRA5 26.226,3.175; EXTRA6 28.765,3.175; EXTRA7 31.305,3.175; EXTRA8 33.846,3.175; EXTRA9 36.386,3.175; EXTRA10 38.925,3.175; EXTRA11 41.465,3.175; EXTRA12 44.005,3.175; EXTRA13 46.545,3.175; EXTRA14 49.086,3.175; EXTRA15 51.626,3.175; EXTRA16 54.166,3.175; EXTRA17 56.706,3.175; EXTRA18 59.245,3.175; EXTRA19 61.785,3.175; EXTRA20 64.326,3.175; EXTRA21 66.865,3.175; EXTRA22 69.406,3.175; GND_4 8.445,3.175; GND_5 10.986,3.175; GND_6 13.525,3.175 | smd 1.651 x 6.35: 3.3VP1 0.826,3.175; 3.3VP2 3.365,3.175; 3.3VP3 5.905,3.175; CAN_H 51.626,3.175; CAN_L 54.166,3.175; EXTRA23 16.066,3.175; EXTRA24 18.605,3.175; EXTRA25 21.145,3.175; EXTRA26 23.686,3.175; EXTRA27 26.226,3.175; EXTRA28 28.765,3.175; EXTRA29 31.305,3.175; EXTRA30 33.846,3.175; EXTRA31 36.386,3.175; EXTRA32 38.925,3.175; EXTRA33 41.465,3.175; EXTRA34 44.005,3.175; EXTRA35 46.545,3.175; GND1 8.445,3.175; GND2 10.986,3.175; GND3 13.525,3.175; KILL_SWITCH 49.086,3.175; SCL_DEPTH 59.245,3.175; SCL_ESC 69.406,3.175; SCL_SENSOR 64.326,3.175; SDA_DEPTH 56.706,3.175; SDA_ESC 66.865,3.175; SDA_SENSOR 61.785,3.175
NANOFIT_4PIN_STR = drill 1.2 pad 2.184: P$1 1.72,1.74; P$2 4.22,1.74; P$3 6.72,1.74; P$4 9.22,1.74 | hole 1.3: 5.47,0.4
USB-MINIB = smd 2.5 x 0.5: D+ 2.5,0; D- 2.5,0.8; GND 2.5,-1.6; ID 2.5,-0.8; VBUS 2.5,1.6 | smd 2.5 x 2: S1 -3,4.5; S2 2.5,4.5; S3 -3,-4.5; S4 2.5,-4.5 | hole 0.9: 0,2.2; 0,-2.2
TO254P450X1020X1935-3P = drill 1.27 square: 1 -5.08,-1.092 | drill 1.27: 2 -2.54,-1.092; 3 0,-1.092

### Placement (x,y rotation side)
3V_LED  36.2,97.16 90 top
3V_R  30.83,82.33 0 top
5V_LED  91.86,97.16 90 top
5V_R  88.16,93.03 0 top
C_FILTER  13.02,25.72 0 top
CAP1  46.04,67.85 180 top
CAP2  37.1,61.54 180 top
CPC1  42.29,47.85 180 top
CPC2  53.67,52.45 270 top
CPC3  32.89,60.26 180 top
CPC5  56.77,58.8 0 top
CPC6  55.87,52.45 270 top
CPC7  34.67,58.5 180 top
CPC8  45.98,65.89 0 top
D+SERIES  33.34,74.93 270 top
D-SERIES  36.2,74.93 270 top
DEBUG  31.5,34.53 90 top
ESC_CONNECTOR_1  93.98,19.34 0 top
ESC_CONNECTOR_2  93.98,28.79 0 top
ESC_CONNECTOR_4  93.98,36.97 0 top
ESC_CONNECTOR_5  93.98,45.15 0 top
ESC_CONNECTOR_6  93.98,53.33 0 top
ESC_CONNECTOR_7  93.98,61.51 0 top
ESC_CONNECTOR_8  93.98,69.68 0 top
ESC_CONNECTOR_9  93.98,77.86 0 top
ESC_CONNECTOR_10  93.98,86.04 0 top
GPIO_CONNECTOR  43.51,26.09 180 top
HB_PC6_LED  40.01,97.16 90 top
HB_PC6_R  39.37,74.93 90 top
HB_PC7_LED  43.81,97.16 90 top
HB_PC7_R  41.91,74.93 90 top
IC1  45.49,56.9 135 top
JTAG_CONNECTOR  4.57,73.43 270 top
O_IN_1  69.53,23.15 0 top
O_IN_2  65.72,30.8 0 top
O_IN_4  69.53,39.51 0 top
O_IN_5  69.53,47.69 0 top
O_IN_6  69.53,55.87 0 top
O_IN_7  69.53,64.05 0 top
O_IN_8  69.53,72.22 0 top
O_IN_9  69.53,80.4 0 top
O_IN_10  69.53,88.58 0 top
O_R1  95.25,12.06 0 top
O_R2  90.49,25.08 270 top
O_R4  87.63,32.97 270 top
O_R5  90.17,41.27 270 top
O_R6  87.63,49.64 270 top
O_R7  90.17,57.78 270 top
O_R8  87.63,66 270 top
O_R9  90.17,73.98 270 top
O_R10  87.63,82.23 270 top
OPTOCOUPLER_1  80.01,19.37 270 top
OPTOCOUPLER_2  80.01,27.55 270 top
OPTOCOUPLER_4  80.01,35.73 270 top
OPTOCOUPLER_5  80.01,43.9 270 top
OPTOCOUPLER_6  80.01,52.08 270 top
OPTOCOUPLER_7  80.01,60.26 270 top
OPTOCOUPLER_8  80.01,68.44 270 top
OPTOCOUPLER_9  80.01,76.62 270 top
OPTOCOUPLER_10  80.01,84.8 270 top
OSC_C1  43.67,37.04 180 top
OSC_C2  48.26,37.11 180 top
OSCILLATOR  47.22,33.01 0 top
PA4_LED  47.62,97.16 90 top
PA4_R  46.35,74.93 90 top
PA5_LED  51.44,97.16 90 top
PA5_R  48.9,74.93 90 top
PC4_LED  59.05,97.16 90 top
PC4_R  53.98,74.93 90 top
PC5_LED  55.24,97.16 90 top
PC5_R  51.44,74.93 90 top
POWER_JACK  5.16,17.35 0 top
R_DS_1  33.98,51.98 90 top
R_DS_2  30.21,52.22 90 top
R_FILTER  12.06,17.78 90 top
RESET  16.46,50.6 0 top
SW1  17.14,66.04 90 top
SWITCH_CONNECTOR  12.11,42.45 270 top
U$1  15.73,0.09 0 top
U$2  37.47,45.72 180 top
USB_CONNECTOR  25.52,94.73 270 top
VOLTAGE_REGULATOR  86.26,12.47 0 top

### Tracks (layer width: path | path; a pad name or v marks a point on that pad's centre or on a via)
3V3  (via drill 0.35)
  Top 0.305: IC1.13 52.27,53.3 CPC2.1 | IC1.64 43.14,49.25 CPC1.1 | IC1.48 38.03,59.05 36.07,59.05 CPC7.1 | R_DS_2.P$2 33.74,56.03 R_DS_1.P$2 35.52,57.33 CPC7.1 | CPC7.1 35.5,58.5 CPC3.1 | CPC8.1 46.9,64.11 IC1.32 | IC1.19 52.55,60.07 54.65,60.07 CPC5.1 | 3V_R.P$1 27.02,75.22 28.57,73.66
  Top 0.762: SWITCH_CONNECTOR.CK7 12.11,25.83 C_FILTER.+ 12.06,25.65 R_FILTER.2
  Top 0.813: SWITCH_CONNECTOR.CK12 SWITCH_CONNECTOR.CK11 SWITCH_CONNECTOR.CK10 SWITCH_CONNECTOR.CK9 SWITCH_CONNECTOR.CK8 SWITCH_CONNECTOR.CK7 | SWITCH_CONNECTOR.CK12 12.11,43.23 13.02,44.13 16.19,44.13 19.68,40.64 34.29,40.64 35.74,42.09 U$2.P$1 38.12,46.35 42.55,46.35 43.14,46.95 CPC1.1 | 41.91,73.66 43.81,71.75 43.81,67.2 CPC8.1 | 27.3,73.66 28.57,73.66 41.91,73.66 | 27.3,73.66 7.34,73.66 JTAG_CONNECTOR.2 JTAG_CONNECTOR.1 1.5,70.36 1.5,49.3 8.35,42.45 SWITCH_CONNECTOR.CK12 | CPC3.1 33.74,67.22 27.3,73.66 | CPC2.1 CPC6.1 55.88,58.76 CPC5.1 55.88,58.84 v55.88,60.33 | v55.88,69.85 55.88,71.75 53.98,73.66 41.91,73.66
  Bottom 0.813: v55.88,69.85 v55.88,60.33
3V3_RAW  (via drill 0.35)
  Top 0.813: v19.05,7.62 19.05,11.75 16.83,13.97 R_FILTER.1 10.16,15.88 10.16,20.32 8.21,22.27 POWER_JACK.1.2 POWER_JACK.1.1
  pour Bottom (no thermals): 22.23,3.17 15.88,3.17 15.88,8.26 22.23,8.26
  pour Top (no thermals): 22.23,3.17 15.88,3.17 15.88,8.26 17.46,9.84 20.64,9.84 22.23,8.26
+5V
  Top 0.813: VOLTAGE_REGULATOR.3 82.23,15.4 82.23,16.19 | 5V_R.P$1 82.23,90.91 82.23,81.92 | 82.23,24.77 82.23,16.19 | 82.23,32.7 82.23,24.77 | 82.23,40.96 82.23,32.7 | 82.23,49.21 82.23,40.96 | 82.23,57.47 82.23,49.21 | 82.23,65.41 82.23,57.47 | 82.23,74.3 82.23,65.41 | 82.23,74.3 82.23,81.92 | OPTOCOUPLER_10.3 82.23,81.92 | OPTOCOUPLER_1.3 83.82,17.78 82.23,16.19 | OPTOCOUPLER_2.3 83.74,26.28 82.23,24.77 | OPTOCOUPLER_4.3 83.82,34.29 82.23,32.7 | OPTOCOUPLER_5.3 83.82,42.55 82.23,40.96 | OPTOCOUPLER_6.3 82.23,49.21 | OPTOCOUPLER_7.3 83.76,58.99 82.23,57.47 | OPTOCOUPLER_8.3 83.82,66.99 82.23,65.41 | OPTOCOUPLER_9.3 83.29,75.35 82.23,74.3
+18V
  Top 0.813: U$1.EXTRA23 31.8,7.67 34.92,10.79 80.6,10.79 VOLTAGE_REGULATOR.1
D+CON
  Top 0.152: USB_CONNECTOR.D+ 25.52,86.1 32.88,78.74 D+SERIES.P$1
D-CON
  Top 0.152: USB_CONNECTOR.D- 26.32,88.04 35.62,78.74 D-SERIES.P$1
DEPTHSCL
  Top 0.152: U$2.P$3 30.75,44.11 30.25,44.6 30.25,48.36 R_DS_2.P$1 31.96,50.16 39.81,50.16 40.54,50.9 | IC1.58 40.54,50.9 | 40.54,50.9 40.44,50.8
DEPTHSDA
  Top 0.152: U$2.P$2 33.24,44.11 33.74,44.6 33.74,47.93 R_DS_1.P$1 34.07,48.26 38.73,48.26 41.76,51.28 41.76,51.31 42.3,51.85 IC1.59
GND  (via drill 0.35, 0.5)
  Top 0.152: IC1.12 49.62,55.24 v49.53,55.24 | IC1.18 50.97,57.78 v50.16,57.78 | CPC1.2 41.35,47.94 v40.01,47.94 | IC1.63 43.72,50.44 42.83,49.56 41.94,49.56 v41.91,49.53
  Top 0.305: 46.83,66.2 CPC8.2 45.19,67.53 CAP1.2 45.09,67.95 v45.09,69.22 | CPC2.2 53.67,51.1 v54.61,50.16 55.87,51.43 CPC6.2 | CPC7.2 33.8,58.5 CPC3.2 30.54,60.26 v30.48,60.33 | CPC5.2 58.67,58.8 v59.05,58.42 | 3V_LED.C HB_PC6_LED.C HB_PC7_LED.C PA4_LED.C PA5_LED.C PC5_LED.C PC4_LED.C 61.35,98.03 v61.59,97.79 | USB_CONNECTOR.GND USB_CONNECTOR.S4 | USB_CONNECTOR.S4 USB_CONNECTOR.S3 USB_CONNECTOR.S1 | USB_CONNECTOR.S1 USB_CONNECTOR.S2 29.84,92.06 v29.84,89.53 | 35.9,97.73 3V_LED.C | USB_CONNECTOR.S4 20.95,92.17 v20.95,89.53 | 3V_LED.C 30.32,98.03 USB_CONNECTOR.S1 | v36.2,62.87 36.2,61.6 CAP2.2
  Top 0.813: POWER_JACK.2 POWER_JACK.3 10.06,11.65 v10.16,11.75
  other vias: 26.67,7.62
  pour Bottom: 0,101.6 77.47,101.6 77.47,10.16 0,10.16 0,11.43
  pour Bottom (no thermals): 29.84,3.17 23.5,3.17 23.5,10.79 29.84,10.79
  pour Top (no thermals): 29.84,3.17 23.5,3.17 23.5,8.26 29.84,8.26
GNDBAT  (via drill 0.35)
  Top 0.152: 5V_LED.C 90.83,99.06 v90.81,99.06
  Top 0.813: U$1.EXTRA24 34.34,7.03 36.2,8.89 82.55,8.89 83.82,10.16 83.82,11.27 VOLTAGE_REGULATOR.2
  pour Bottom: 82.55,10.16 101.6,10.16 101.6,101.6 82.55,101.6
HEARTBEAT_1
  Top 0.152: IC1.37 43.27,61.59 43.81,61.59 45.09,62.87 45.09,63.5 39.37,69.22 HB_PC6_R.P$1
HEARTBEAT_2
  Top 0.152: IC1.38 42.4,61.85 43.02,61.24 43.96,61.24 45.44,62.72 45.44,63.65 41.85,67.24 HB_PC7_R.P$1
HEAVE_PORT_AFT
  Top 0.152: IC1.27 51.27,64.45 59.37,64.45 65.72,70.8 O_IN_8.P$1
HEAVE_PORT_FWD
  Top 0.152: IC1.26 51.02,63.5 66.04,63.5 O_IN_7.P$1
HEAVE_STBD_AFT
  Top 0.152: IC1.23 50.18,60.44 51.38,61.63 60.16,61.63 65.28,56.52 65.41,56.52 65.72,56.2 O_IN_6.P$1
HEAVE_STBD_FWD
  Top 0.152: IC1.22 51.63,61.28 60.01,61.28 63.82,57.47 63.82,53.02 65.72,51.12 O_IN_5.P$1
JTAG_5
  Top 0.152: JTAG_CONNECTOR.5 6.07,69.85 SW1.5 13.97,69.85 15.24,68.58 15.24,66.67 SW1.7
JTAG_7
  Top 0.152: SW1.6 6.07,67.31 JTAG_CONNECTOR.7 5.62,64.77 10.16,64.77 12.7,62.23 SW1.8
KILL_SWITCH  (via drill 0.35)
  Top 0.152: U$1.KILL_SWITCH 64.82,7.57 v64.77,7.62 | 47.96,51.15 IC1.4 48.9,50.31 48.9,46.04 v48.58,45.72 | v53.66,45.72 53.66,23.81 v64.77,12.7
  Bottom 0.152: v64.77,7.62 v64.77,12.7 | v48.58,45.72 v53.66,45.72
MISSION_START
  Top 0.152: IC1.8 51.63,50.4 51.63,28.14 46.04,22.54 27.62,22.54 25.72,24.45 25.72,33.02 16.29,42.45 SWITCH_CONNECTOR.CK6 15.34,42.45
N$1
  Top 0.152: OPTOCOUPLER_1.4 86.36,20.64 87.63,19.37 93.95,19.37 ESC_CONNECTOR_1.1 93.98,14.61 O_R1.P$1
N$2
  Top 0.152: OPTOCOUPLER_2.4 84.85,28.82 86.04,27.62 89.22,27.62 O_R2.P$1 93.88,28.89 ESC_CONNECTOR_2.1
N$3
  Top 0.152: O_IN_1.P$2 75.86,20.64 OPTOCOUPLER_1.1
N$6
  Top 0.152: OPTOCOUPLER_4.4 87.41,36.99 O_R4.P$1 87.68,36.78 88.58,35.88 92.89,35.88 ESC_CONNECTOR_4.1
N$7
  Top 0.152: O_R5.P$1 90.08,45.17 | O_R5.P$1 93.92,45.09 ESC_CONNECTOR_5.1 | OPTOCOUPLER_5.4 84.68,45.17 85.72,44.13 89.22,44.13 O_R5.P$1
N$8
  Top 0.152: OPTOCOUPLER_6.4 87.53,53.35 O_R6.P$1 87.63,53.34 88.9,52.07 92.72,52.07 ESC_CONNECTOR_6.1
N$9
  Top 0.152: O_R7.P$1 90.11,61.53 | O_R7.P$1 93.89,61.59 ESC_CONNECTOR_7.1 | OPTOCOUPLER_7.4 85.15,61.53 86.04,60.64 89.22,60.64 O_R7.P$1
N$10
  Top 0.152: OPTOCOUPLER_8.4 87.21,69.71 O_R8.P$1 87.35,69.81 88.27,68.9 93.19,68.9 ESC_CONNECTOR_8.1
N$11
  Top 0.152: O_R9.P$1 89.43,77.89 | ESC_CONNECTOR_9.1 90.88,77.86 O_R9.P$1 | OPTOCOUPLER_9.4 84.67,77.89 85.72,76.83 89.22,76.83 O_R9.P$1
N$12
  Top 0.152: OPTOCOUPLER_10.4 87.61,86.07 O_R10.P$1 ESC_CONNECTOR_10.1
N$13
  Top 0.152: O_IN_10.P$2 75.86,86.07 OPTOCOUPLER_10.1
N$14
  Top 0.152: O_IN_9.P$2 75.86,77.89 OPTOCOUPLER_9.1
N$15
  Top 0.152: O_IN_8.P$2 75.86,69.71 OPTOCOUPLER_8.1
N$16
  Top 0.152: O_IN_7.P$2 75.86,61.53 OPTOCOUPLER_7.1
N$17
  Top 0.152: O_IN_6.P$2 75.86,53.35 OPTOCOUPLER_6.1
N$18
  Top 0.152: O_IN_5.P$2 75.86,45.17 OPTOCOUPLER_5.1
N$19
  Top 0.152: O_IN_4.P$2 75.86,36.99 OPTOCOUPLER_4.1
N$21
  Top 0.152: O_IN_2.P$2 71.51,28.82 OPTOCOUPLER_2.1
N$36
  Top 0.152: HB_PC6_R.P$2 40.01,79.38 HB_PC6_LED.A
N$37
  Top 0.152: HB_PC7_R.P$2 43.81,80.64 HB_PC7_LED.A
N$38
  Top 0.152: PC5_R.P$2 55.24,82.55 PC5_LED.A
N$39
  Top 0.152: PC4_LED.A 59.05,83.19 54.61,78.74 PC4_R.P$2
N$40
  Top 0.152: PA5_LED.A 50.8,95.64 50.8,80.64 PA5_R.P$2
N$41
  Top 0.152: PA4_R.P$2 47.62,80.01 PA4_LED.A
N$42
  Top 0.152: 5V_LED.A 91.97,96.17 5V_R.P$2
N$43
  Top 0.152: 3V_R.P$2 36.2,83.89 3V_LED.A
NRST  (via drill 0.35)
  Top 0.152: IC1.7 44.81,56.52 38.73,56.52 35.56,53.34 29.21,53.34 v28.57,53.98 | JTAG_CONNECTOR.15 4.67,55.65 5.71,54.61 11.46,54.61 RESET.1 RESET.2
  Bottom 0.152: RESET.2 19.84,52.86 20.95,53.98 v28.57,53.98
PA4  (via drill 0.35)
  Top 0.152: IC1.20 50.5,58.74 47.62,58.74 v46.99,59.37 | v49.21,66.99 49.21,68.89 PA4_R.P$1
  Bottom 0.152: v46.99,59.37 46.99,64.77 v49.21,66.99
PA5  (via drill 0.35)
  Top 0.152: IC1.21 50.15,59.09 48.85,59.09 v48.26,59.69 | v50.48,66.99 50.48,69.7 PA5_R.P$1
  Bottom 0.152: v48.26,59.69 48.26,64.77 v50.48,66.99
PB8
  Top 0.152: IC1.61 43.11,51.24 43.66,51.8 44.39,51.8 45.72,50.47 45.72,44.95 40.56,39.8 40.56,31.2 38.43,29.06 GPIO_CONNECTOR.3
PB9
  Top 0.152: DEBUG.4 DEBUG.3 | DEBUG.4 | IC1.62 43.41,50.84 44.01,51.44 44.24,51.44 45.09,50.59 45.09,44.83 40.29,40.03 | 40.29,40.03 40.2,39.94 | 40.29,40.03 38.04,37.78 DEBUG.4
PC4  (via drill 0.35)
  Top 0.152: IC1.24 51.14,62.21 51.71,62.21 52.37,62.87 v52.7,62.87 | v53.02,66.36 53.02,69.22 53.02,69.25 53.02,70.52 PC4_R.P$1
  Bottom 0.152: v52.7,62.87 52.09,63.48 52.09,65.43 v53.02,66.36
PC5  (via drill 0.35)
  Top 0.152: IC1.25 51.09,62.87 v51.44,62.87 | v51.44,66.67 PC5_R.P$1
  Bottom 0.152: v51.44,62.87 v51.44,66.67
PC13
  Top 0.152: IC1.2 48.18,49.61 48.18,46.91 40.92,39.65 40.92,26.14 GPIO_CONNECTOR.2
RCC_OSC_IN
  Top 0.152: IC1.5 48.31,51.5 49.25,50.56 49.25,45.46 49.21,45.42 49.21,41.31 OSC_C1.1 44.94,33.15 OSCILLATOR.1
RCC_OSC_OUT
  Top 0.152: OSCILLATOR.2 49.53,33.11 OSC_C2.1 50.48,38.06 50.48,50.16 48.7,51.95 IC1.6
SCL_BKPLN  (via drill 0.35)
  Top 0.152: IC1.41 41.24,60.69 41.79,60.15 41.79,60.13 41.91,60.01 v41.91,59.37 | v54.93,45.72 54.93,24.13 66.04,13.02 v78.11,13.02 | U$1.SCL_SENSOR 80.01,3.31 v80.01,7.3
  Bottom 0.152: v41.91,59.37 54.93,46.35 v54.93,45.72 | v80.01,7.3 79.38,7.94 79.38,11.75 v78.11,13.02
SDA_BKPLN  (via drill 0.35)
  Top 0.152: IC1.40 41.69,61.15 42.24,60.6 42.27,60.6 42.55,60.33 v42.86,60.33 | U$1.SDA_SENSOR 77.47,3.31 v77.47,7.3 | v75.56,16.19 66.04,16.19 56.52,25.72 v56.52,45.4
  Bottom 0.152: v42.86,60.33 56.52,46.67 v56.52,45.4 | v77.47,7.3 75.56,9.21 v75.56,16.19
SURGEPORTHI  (via drill 0.35)
  Top 0.152: IC1.16 54.54,55.49 v54.61,55.56 | v58.74,53.34 58.74,36.51 65.72,29.53 O_IN_1.P$1
  Bottom 0.152: v54.61,55.56 55.2,54.97 57.43,54.97 58.42,53.98 v58.74,53.34
SURGEPORTLOW  (via drill 0.35)
  Top 0.152: IC1.17 52.94,59.05 v53.98,59.05 | v57.15,55.88 61.59,51.44 61.59,46.67 65.72,42.55 O_IN_4.P$1
  Bottom 0.152: v53.98,59.05 v57.15,55.88
SURGESTBDLOW  (via drill 0.35)
  Top 0.152: IC1.15 51.95,55.13 52.49,54.59 52.73,54.59 52.75,54.61 v53.98,54.61 | v57.15,53.98 57.78,53.34 57.78,34.92 O_IN_2.P$1
  Bottom 0.152: v53.98,54.61 56.52,54.61 v57.15,53.98
SW_AFT
  Top 0.152: IC1.29 50.45,65.05 57.62,65.05 60.68,68.11 60.68,74.97 O_IN_9.P$1
SW_FWD
  Top 0.152: 47.61,63.01 IC1.30 | IC1.30 47.67,62.91 | IC1.30 47.67,62.91 | 47.67,62.91 50.16,65.41 57.47,65.41 60.33,68.26 60.33,83.19 O_IN_10.P$1
SWITCH_3
  Top 0.152: IC1.9 51.99,50.75 51.99,27.86 | 51.99,27.94 51.99,27.86 | 51.99,27.86 46.04,21.91 27.3,21.91 24.77,24.45 24.77,31.11 15.93,39.95 SWITCH_CONNECTOR.CK5
SWITCH_4
  Top 0.152: IC1.10 52.35,51.1 52.35,27.58 46.04,21.27 26.99,21.27 23.81,24.45 23.81,30.8 17.16,37.45 SWITCH_CONNECTOR.CK4
SWITCH_5
  Top 0.152: IC1.11 51.44,52.72 51.44,52.7 52.7,51.44 52.7,27.3 46.04,20.64 26.35,20.64 22.86,24.13 22.86,30.8 18.71,34.95 SWITCH_CONNECTOR.CK3
SWITCH_6  (via drill 0.35)
  Top 0.152: IC1.3 48.54,49.96 48.54,46.63 41.27,39.37 41.27,31.11 42.23,30.16 42.23,24.77 40.96,23.5 28.26,23.5 v27.3,24.45 | SWITCH_CONNECTOR.CK2 16.76,32.45 21.27,27.94 v21.27,25.4
  Bottom 0.152: v27.3,24.45 22.23,24.45 v21.27,25.4
SYS_JTCK-SWCLK  (via drill 0.35)
  Top 0.152: 35.98,52.7 35.88,52.7 | 35.88,52.7 v28.57,52.7 | v22.23,52.7 15.24,59.69 12.06,59.69 9.53,62.23 5.62,62.23 JTAG_CONNECTOR.9 | 35.88,52.7 35.98,52.7 | 35.98,52.7 IC1.49
  Bottom 0.152: v28.57,52.7 v22.23,52.7
SYS_JTDI
  Top 0.152: IC1.46 40.02,58.48 40.02,58.15 40.01,58.13 40.01,57.78 39.37,57.15 38.73,57.15 35.56,53.98 29.84,53.98 23.5,60.33 23.5,65.41 21.59,67.31 SW1.3 SW1.4
SYS_JTDO-SWO
  Top 0.152: IC1.55 38.96,51.44 10.16,51.44 9.53,52.07 3.81,52.07 3.17,52.7 3.17,56.79 JTAG_CONNECTOR.13
SYS_JTMS-SWIDIO
  Top 0.152: SW1.2 SW1.1 20.95,59.39 28.3,52.05 36.03,52.05 IC1.50
SYS_JTRST
  Top 0.152: IC1.56 39.03,50.8 29.84,50.8 26.04,46.99 6.35,46.99 2.59,50.75 2.59,68.91 JTAG_CONNECTOR.3
USB_OTG_HS_DM
  Top 0.152: IC1.35 36.2,70.08 D-SERIES.P$2
USB_OTG_HS_DP
  Top 0.152: D+SERIES.P$2 40.96,63.5 42.07,63.5 IC1.36
VCAP1
  Top 0.305: IC1.31 48.26,64.27 48.26,67.31 47.72,67.85 CAP1.1
VCAP2
  Top 0.305: IC1.47 | IC1.47 38.42,59.37 38.42,61.07 CAP2.1

### Text on the board
tNames: 5V | 3.3V | PC6 | PC7 | PA4 | PA5 | PC5 | PC4 | SwF | SwA | HPA | 5 | 7 | JTDI | 5 | HPF | 7 | SWDIO | HSA | HSF | Start | SPL | SSL | Spare | PB8 | PC13 | The Ohio State Univeristy / Center For Automotive Research / Underwater Robotics Team / CoProcessor Board -- Rev. 3.0